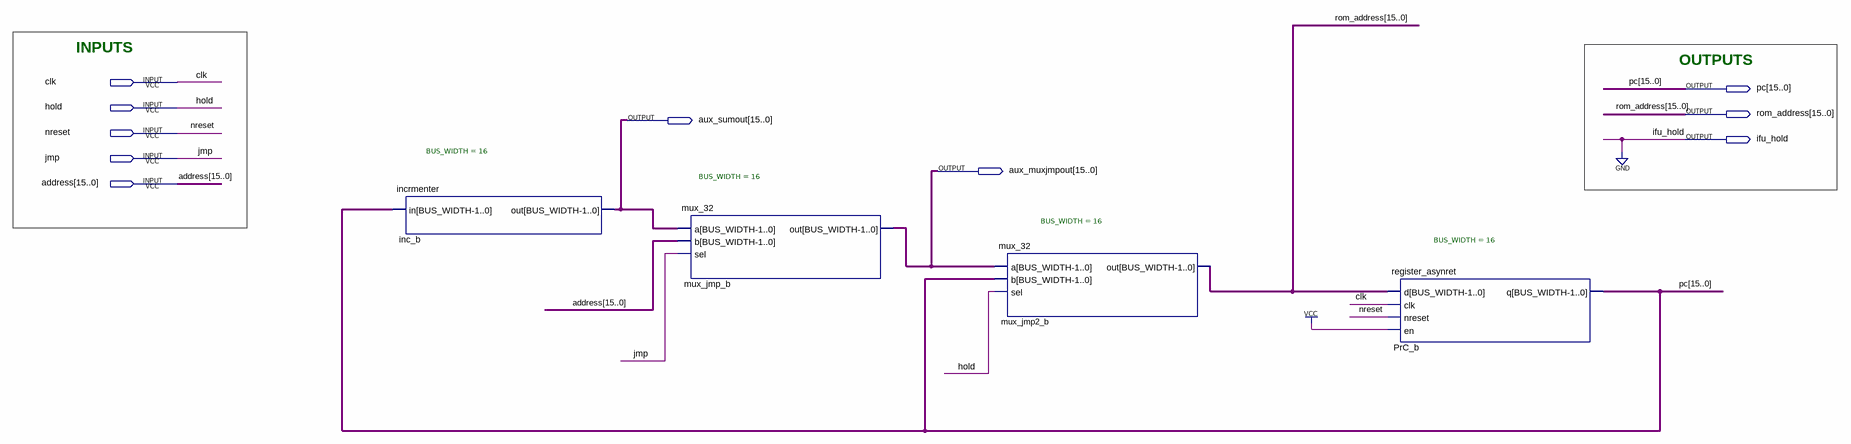
[diagram p0: schematic sheet]
// Quartus schematic ifu_rev.bdf as structural Verilog: 4 symbols, 10 pins
module ifu_rev (
  input  clk,
  input  hold,
  input  nreset,
  input  jmp,
  input  [15:0] address,
  output [15:0] pc,
  output [15:0] rom_address,
  output [15:0] aux_sumout,
  output ifu_hold,
  output [15:0] aux_muxjmpout
);

  incrmenter #(.BUS_WIDTH(16)) inc_b (.in(pc), .out(aux_sumout));
  mux_32 #(.BUS_WIDTH(16)) mux_jmp_b (.a(aux_sumout), .b(address), .sel(jmp), .out(aux_muxjmpout));
  mux_32 #(.BUS_WIDTH(16)) mux_jmp2_b (.a(aux_muxjmpout), .b(pc), .sel(hold), .out(rom_address));
  register_asynret #(.BUS_WIDTH(16)) PrC_b (.d(rom_address), .clk(clk), .nreset(nreset), .en(1'b1), .q(pc));

  assign ifu_hold = 1'b0;

  // Notes on the sheet:
  //   INPUTS
  //   OUTPUTS
endmodule
